# Altium schematic sheet karmanDB_amp.SchDoc
size A
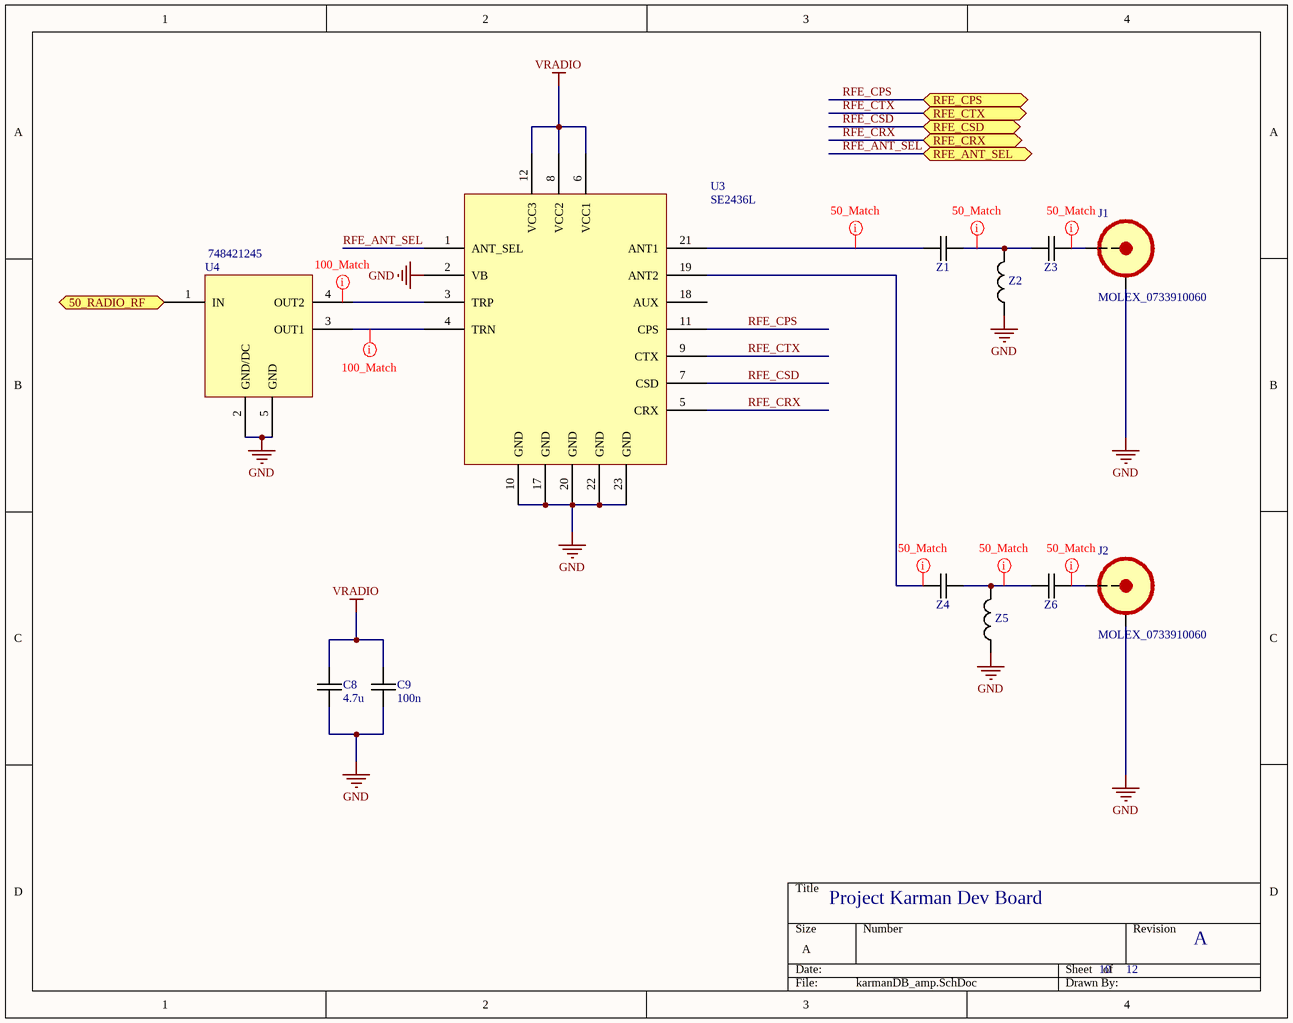
[diagram p0: karmanDB_amp.SchDoc]

## Parts
C8  4.7u  [MURATA_GRM_0603]
C9  100n  [MURATA_GRM_0603]
J1  MOLEX_0733910060  [MOLEX_0733910060]
J2  MOLEX_0733910060  [MOLEX_0733910060]
U3  SE2436L  [9 SE2436L]
U4  748421245  [748421245]
Z1  CAP_GENERIC_0402  [MURATA_GRM_0402]  (value not drawn)
Z2  IND_GENERIC_0402  [PANASONIC_ELJRF]  (value not drawn)
Z3  CAP_GENERIC_0402  [MURATA_GRM_0402]  (value not drawn)
Z4  CAP_GENERIC_0402  [MURATA_GRM_0402]  (value not drawn)
Z5  IND_GENERIC_0402  [PANASONIC_ELJRF]  (value not drawn)
Z6  CAP_GENERIC_0402  [MURATA_GRM_0402]  (value not drawn)

## Ports
50_RADIO_RF (in), RFE_ANT_SEL (bidir), RFE_CPS (bidir), RFE_CRX (bidir), RFE_CSD (bidir), RFE_CTX (bidir)

## Nets
GND: C8.2 C9.2 J1.SHIELD J2.SHIELD U3.2(VB) U3.10(GND) U3.17(GND) U3.20(GND) U3.22(GND) U3.23(GND) U4.2(GND/DC) U4.5(GND) Z2.1 Z5.1
VRADIO: C8.1 C9.1 U3.6(VCC1) U3.8(VCC2) U3.12(VCC3)
50_RADIO_RF: U4.1(IN) ; port 50_RADIO_RF
RFE_ANT_SEL: U3.1(ANT_SEL) ; port RFE_ANT_SEL
RFE_CPS: U3.11(CPS) ; port RFE_CPS
RFE_CRX: U3.5(CRX) ; port RFE_CRX
RFE_CSD: U3.7(CSD) ; port RFE_CSD
RFE_CTX: U3.9(CTX) ; port RFE_CTX
NetJ1_PIN: J1.PIN Z3.2
NetJ2_PIN: J2.PIN Z6.2
NetU3_3: U3.3(TRP) U4.4(OUT2)
NetU3_4: U3.4(TRN) U4.3(OUT1)
NetU3_19: U3.19(ANT2) Z4.1
NetU3_21: U3.21(ANT1) Z1.1
NetZ1_2: Z1.2 Z2.2 Z3.1
NetZ4_2: Z4.2 Z5.2 Z6.1

Not connected (* = marked no-connect by the designer): U3 18(AUX)

## Layout directives
net class 50_Match_Class: NetJ1_PIN, NetJ2_PIN, NetU3_19, NetU3_21, NetZ1_2, NetZ4_2
net class 100_Match_Class: (no net found under the mark), NetU3_4

## Notes on the sheet
- Project Karman Dev Board
- 10
- 12
- A

## Library data of the parts
C8 = CAP_MURATA_GRM188R61C475MAAJD: CAP CER 4.7UF 16V 20% X5R 0603; Manufacturer: Murata Electronics North America; Capacitance: 4.7µF; Supplier 1: Digi-Key; Supplier Part Number 1: 490-10482-1-ND; Manufacturer Part Number: GRM188R61C475MAAJD; RoHS: RoHS Compliant; Category: Capacitors; Stock 1: 3465; Pricing: 1=0.3, 10=0.251, 25=0.1728, 50=0.1414, 100=0.1256, 250=0.0942, 500=0.08322, 1000=0.07379 (USD); Packaging: Cut Tape (CT); Tolerance: ±20%; Voltage - Rated: 16V; Temperature Coefficient: X5R; Mounting Type: Surface Mount, MLCC; Operating Temperature: -55°C ~ 85°C; Applications: General Purpose; Ratings: -; Package / Case: 0603 (1608 Metric); Size / Dimension: 0.063" L x 0.031" W (1.60mm x 0.80mm); Height - Seated (Max): -; Thickness (Max): 0.037" (0.95mm); Lead Spacing: -; Features: -; Lead Style: -; ComponentLink1URL: http://www.murata.com/~/media/webrenewal/support/library/catalog/products/capacitor/mlcc/c02e.ashx; ComponentLink1Description: http://www.murata.com/~/media/webrenewal/support/library/catalog/products/capacitor/mlcc/c02e.ashx
C9 = CAP_MURATA_GRM188R71C104KA01D: CAP CER 0.1UF 16V 10% X7R 0603; Manufacturer: Murata Electronics North America; Capacitance: 0.1µF; Supplier 1: Digi-Key; Supplier Part Number 1: 490-1532-1-ND; Manufacturer Part Number: GRM188R71C104KA01D; RoHS: RoHS Compliant; Category: Capacitors; Stock 1: 2486193; Pricing: 1=0.1, 10=0.019, 50=0.0102, 100=0.0086, 250=0.00704, 500=0.006, 1000=0.00468 (USD); Packaging: Cut Tape (CT); Tolerance: ±10%; Voltage - Rated: 16V; Temperature Coefficient: X7R; Mounting Type: Surface Mount, MLCC; Operating Temperature: -55°C ~ 125°C; Applications: General Purpose; Ratings: -; Package / Case: 0603 (1608 Metric); Size / Dimension: 0.063" L x 0.031" W (1.60mm x 0.80mm); Height - Seated (Max): -; Thickness (Max): 0.035" (0.90mm); Lead Spacing: -; Features: -; Lead Style: -; ComponentLink1URL: http://www.murata.com/~/media/webrenewal/support/library/catalog/products/capacitor/mlcc/c02e.ashx; ComponentLink1Description: http://www.murata.com/~/media/webrenewal/support/library/catalog/products/capacitor/mlcc/c02e.ashx
J1 J2 = MOLEX_0733910060: CONN SMA JACK STR 50 OHM PCB; Manufacturer: Molex Inc; Connector Type: Jack, Female Socket; Contact Termination: Solder; Impedance: 50 Ohm; Frequency - Max: 18GHz; Body Material: Brass; Body Finish: Gold; Center Contact Material: Beryllium Copper; Dielectric Material: Polytetrafluoroethylene (PTFE); Voltage Rating: 500V; Supplier 1: Digi-Key; Manufacturer Part Number: 0733910060; RoHS: RoHS Compliant; Category: Connectors, Interconnects; Stock 1: 6663; Packaging: Bulk; Connector Style: SMA; Shield Termination: Solder; Mounting Type: Through Hole; Cable Group: -; Fastening Type: Threaded; Features: -; Housing Color: Gold; Ingress Protection: -; Center Contact Plating: Gold; Operating Temperature: -65°C ~ 165°C; ComponentLink1URL: http://www.molex.com/pdm_docs/sd/733910060_sd.pdf; ComponentLink1Description: http://www.molex.com/pdm_docs/sd/733910060_sd.pdf; Supplier Part Number 1: WM5543-ND; Pricing: 1=2.99, 10=2.87, 25=2.6308, 50=2.5114, 100=2.3918, 250=2.09284, 500=2.03304, 1000=1.73406, 2500=1.61446 (USD)
U3 = SE2436L: ZIGBEE FRONT END MODULE; Manufacturer: Skyworks Solutions Inc.; Supplier 1: Digi-Key; Manufacturer Part Number: SE2436L; RoHS: RoHS Compliant; Category: RF/IF and RFID; Stock 1: 0; Pricing 1: 3000=1.5 (USD); ComponentLink1URL: http://www.skyworksinc.com/uploads/documents/SE2436L_202413C.pdf; ComponentLink1Description: http://www.skyworksinc.com/uploads/documents/SE2436L_202413C.pdf; Supplier Part Number 1: SE2436L-ND
U4 = 748421245: BALUN EMBER351 & 357 0805 SMD; Manufacturer: Wurth Electronics Inc; Frequency Range: 2.4GHz ~ 2.5GHz; Impedance - Unbalanced/Balanced: 50 / 100 Ohm; Phase Difference: 180° ±10; Insertion Loss (Max): 1.0dB; Supplier 1: Digi-Key; Manufacturer Part Number: 748421245; RoHS: RoHS Compliant; Category: RF/IF and RFID; Stock 1: 20266; Pricing 1: 1=2.63, 50=2.3626, 100=2.1875, 500=2.0125, 1000=1.925, 2000=1.8375 (USD); Packaging: Cut Tape (CT); Return Loss (Min): -; Package / Case: 0805 (2012 Metric); Mounting Type: Surface Mount; ComponentLink1URL: http://katalog.we-online.de/pbs/datasheet/748421245.pdf; ComponentLink1Description: http://katalog.we-online.de/pbs/datasheet/748421245.pdf; Supplier Part Number 1: 732-2230-1-ND
Z1 Z3 Z4 Z6 = CAP_GENERIC_0402: Generic Capacitor 0402 Package; Capacitance: 1000pF; Category: Capacitors; Applications: General Purpose; Size / Dimension: 0.039" L x 0.020" W (1.00mm x 0.50mm); Package / Case: 0402 (1005 Metric); Mounting Type: Surface Mount, MLCC
Z2 Z5 = IND_GENERIC_0402: Generic Inductor 0402 Package; Mounting Type: Surface Mount; Package / Case: 0402 (1005 Metric)